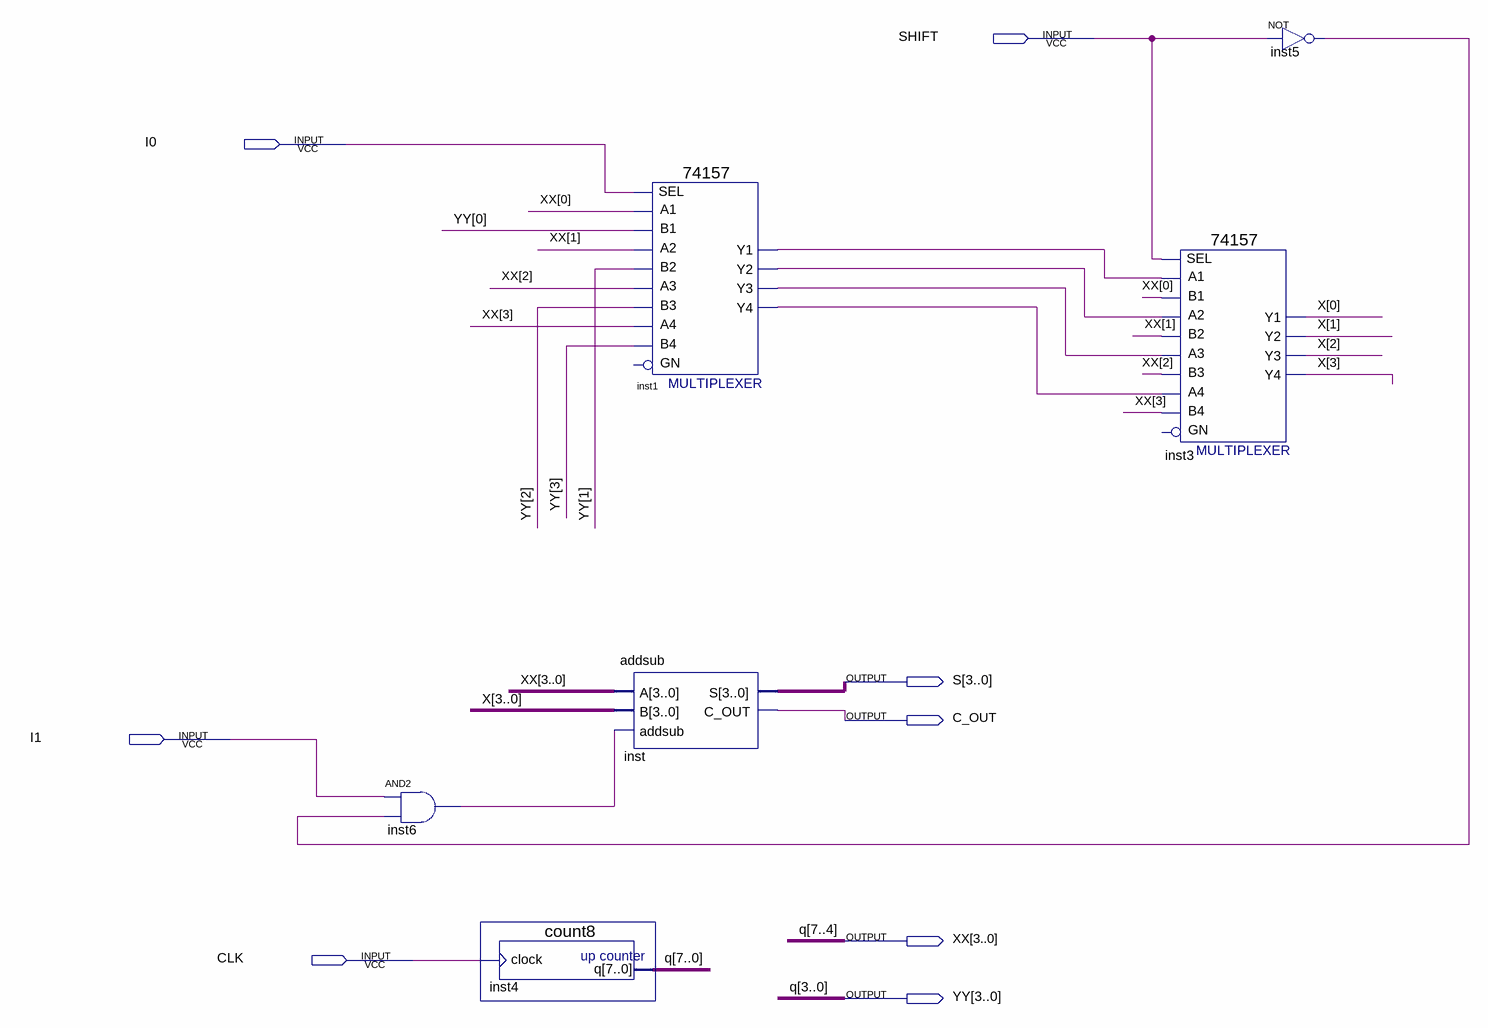
[diagram p0: schematic sheet]
// Quartus schematic alu2.bdf as structural Verilog: 6 symbols, 8 pins
module alu2 (
  input  SHIFT,
  input  I0,
  input  I1,
  input  CLK,
  output [3:0] S,
  output C_OUT,
  output [3:0] XX,
  output [3:0] YY
);

  wire inst1_y1, inst1_y2, inst1_y3, inst1_y4, inst5_out, inst6_out;
  wire [3:0] X;

  and inst6 (inst6_out, I1, inst5_out);
  count8 inst4 (.clock(CLK), .q({XX, YY}));
  \74157  inst1 (
    .A1(XX[0]), .B1(YY[0]), .B2(YY[1]), .A3(XX[2]), .B3(YY[2]), .A2(XX[1]), .B4(YY[3]), .A4(XX[3]), .SEL(I0),
    .Y2(inst1_y2), .Y1(inst1_y1), .Y4(inst1_y4), .Y3(inst1_y3));  // open: GN
  addsub inst (.A(XX), .B(X), .addsub(inst6_out), .S(S), .C_OUT(C_OUT));
  \74157  inst3 (
    .A1(inst1_y1), .B1(XX[0]), .B2(XX[1]), .A3(inst1_y3), .B3(XX[2]), .A2(inst1_y2), .B4(XX[3]),
    .A4(inst1_y4), .SEL(SHIFT), .Y2(X[1]), .Y1(X[0]), .Y4(X[3]), .Y3(X[2]));  // open: GN
  not inst5 (inst5_out, SHIFT);

  // Other names for the same wires on the sheet: q[7:0] = {XX, YY}
endmodule
